# EAGLE design M602A (EAGLE 6.6.0)
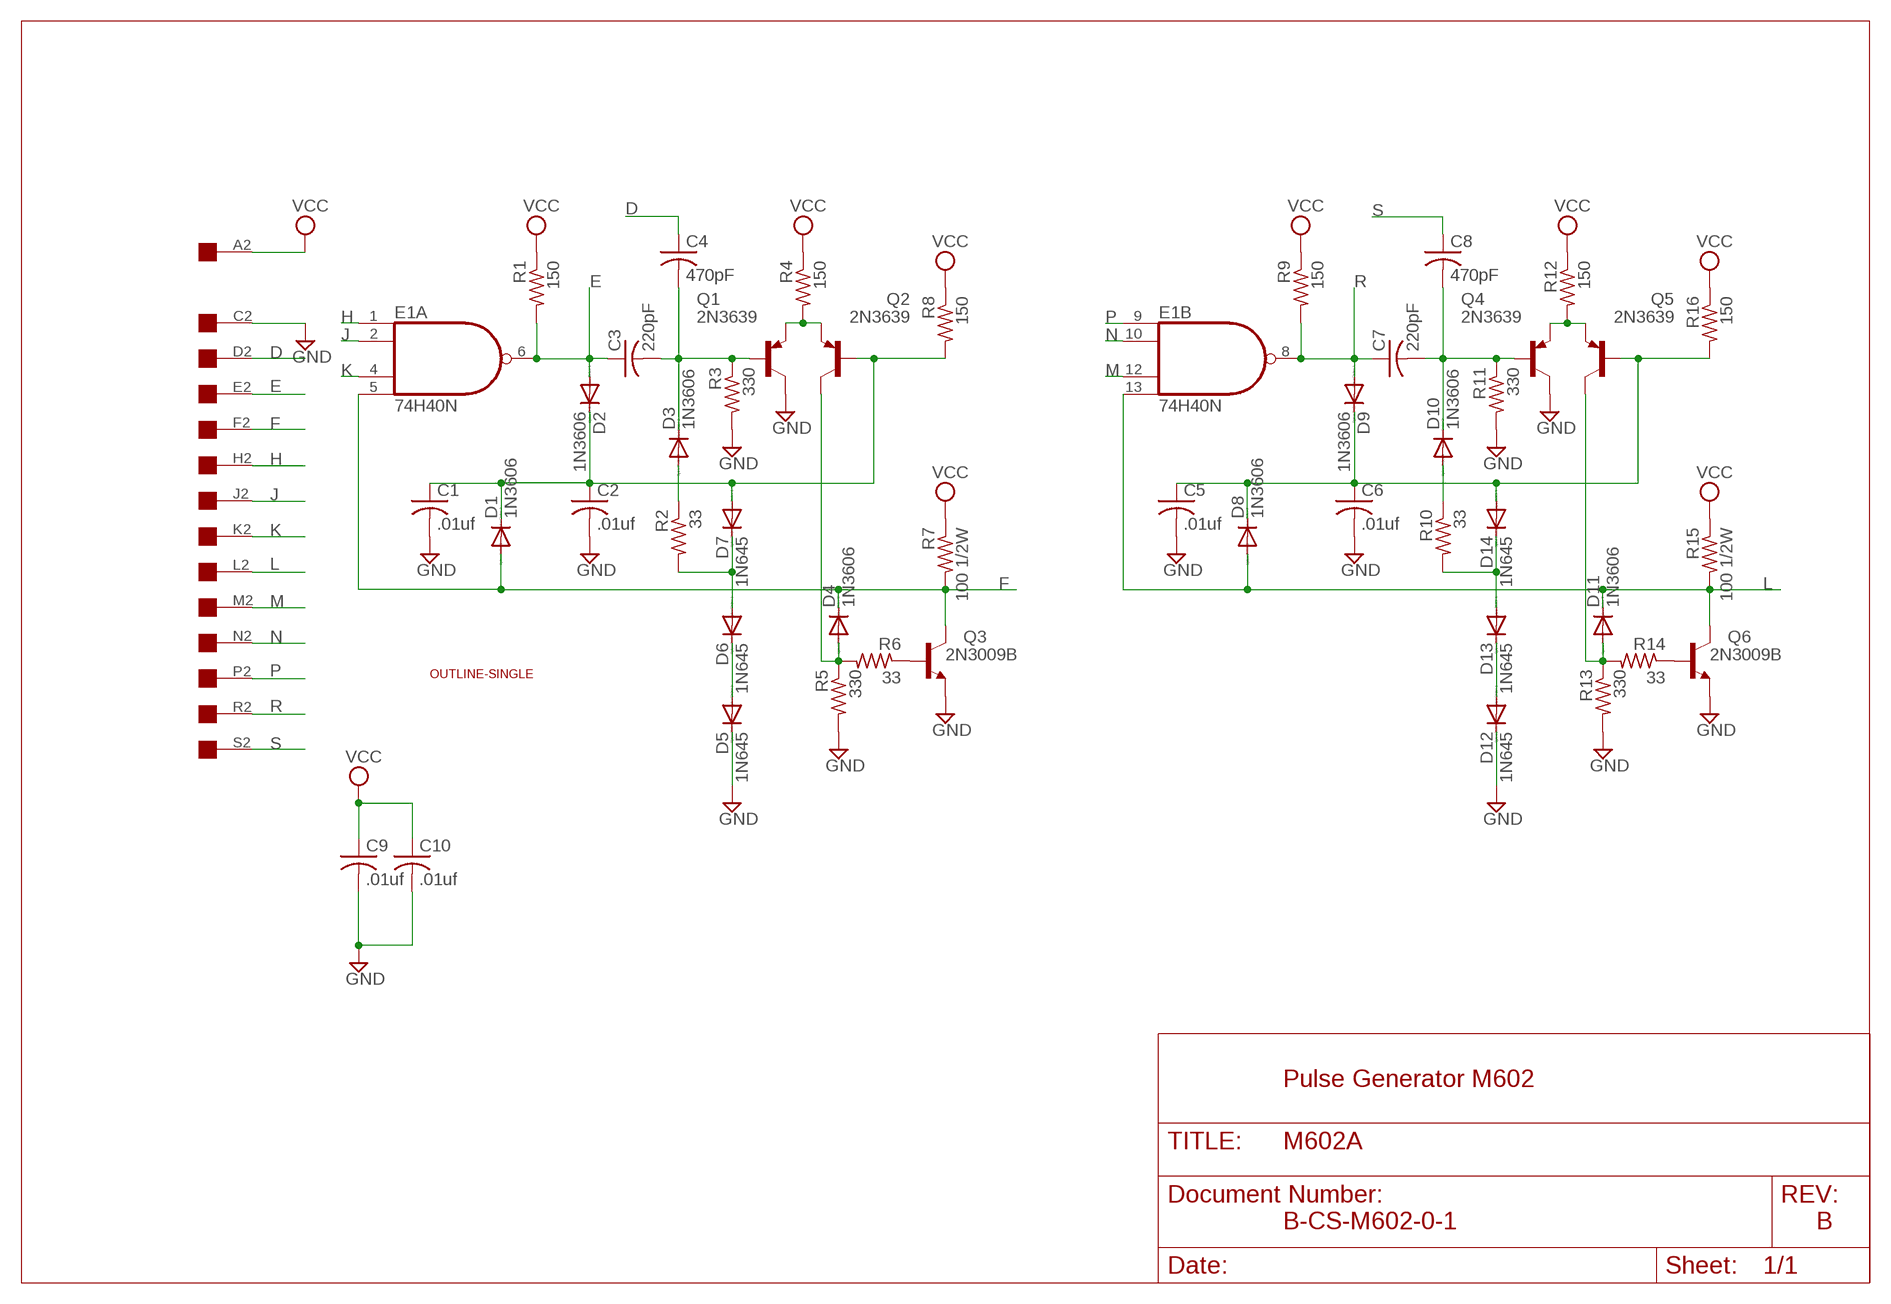
[diagram p0: schematic, sheet 1]

## Parts
C1  .01uf  C-US075-032X103  [C075-032X103]
C2  .01uf  C-US075-032X103  [C075-032X103]
C3  220pF  C-US150-054X183  [C150-054X183]
C4  470pF  C-US150-054X183  [C150-054X183]
C5  .01uf  C-US075-032X103  [C075-032X103]
C6  .01uf  C-US075-032X103  [C075-032X103]
C7  220pF  C-US150-054X183  [C150-054X183]
C8  470pF  C-US150-054X183  [C150-054X183]
C9  .01uf  C-US050-025X075  [C050-025X075]
C10  .01uf  C-US075-032X103  [C075-032X103]
D1  1N3606  1N4004  [DO41-10]
D2  1N3606  1N4004  [DO41-10]
D3  1N3606  1N4004  [DO41-10]
D4  1N3606  1N4004  [DO41-10]
D5  1N645  1N4004  [DO41-10]
D6  1N645  1N4004  [DO41-10]
D7  1N645  1N4004  [DO41-10]
D8  1N3606  1N4004  [DO41-10]
D9  1N3606  1N4004  [DO41-10]
D10  1N3606  1N4004  [DO41-10]
D11  1N3606  1N4004  [DO41-10]
D12  1N645  1N4004  [DO41-10]
D13  1N645  1N4004  [DO41-10]
D14  1N645  1N4004  [DO41-10]
E1  74H40N  74LS20N  [DIL14]
Q1  2N3639  2N5415  [TO39]
Q2  2N3639  2N5415  [TO39]
Q3  2N3009B  2N1711  [TO39]
Q4  2N3639  2N5415  [TO39]
Q5  2N3639  2N5415  [TO39]
Q6  2N3009B  2N1711  [TO39]
R1  150  R-US_0207/10  [0207/10]
R2  33  R-US_0207/10  [0207/10]
R3  330  R-US_0207/10  [0207/10]
R4  150  R-US_0207/10  [0207/10]
R5  330  R-US_0207/10  [0207/10]
R6  33  R-US_0207/10  [0207/10]
R7  100 1/2W  R-US_0309/12  [0309/12]
R8  150  R-US_0207/10  [0207/10]
R9  150  R-US_0207/10  [0207/10]
R10  33  R-US_0207/10  [0207/10]
R11  330  R-US_0207/10  [0207/10]
R12  150  R-US_0207/10  [0207/10]
R13  330  R-US_0207/10  [0207/10]
R14  33  R-US_0207/10  [0207/10]
R15  100 1/2W  R-US_0309/12  [0309/12]
R16  150  R-US_0207/10  [0207/10]
U$1  EDGE-1  [EDGE-CON1]
U$2  OUTLINE-SINGLE  [SINGLE]

## Nets
D: C4.1 U$1.D2
E: C3.1 D2.A E1.6(A:O) R1.2 U$1.E2
F: D1.A D4.C E1.5(A:I3) Q3.3(C) R7.2 U$1.F2
GND [Supply]: C1.2 C2.2 C5.2 C6.2 C9.2 C10.2 D5.C D12.C Q1.3(C) Q3.1(E) Q4.3(C) Q6.1(E) R3.2 R5.2 R11.2 R13.2 U$1.C2
H: E1.1(A:I0) U$1.H2
J: E1.2(A:I1) U$1.J2
K: E1.4(A:I2) U$1.K2
L: D8.A D11.C E1.13(B:I3) Q6.3(C) R15.2 U$1.L2
M: E1.12(B:I2) U$1.M2
N: E1.10(B:I1) U$1.N2
N$1: C1.1 C2.1 D1.C D2.C D7.A Q2.2(B) R8.2
N$2: D3.A R2.1
N$3: D10.A R10.1
N$4: C3.2 C4.2 D3.C Q1.2(B) R3.1
N$5: Q1.1(E) Q2.1(E) R4.2
N$6: D4.A Q2.3(C) R5.1 R6.2
N$7: Q3.2(B) R6.1
N$8: D6.A D7.C R2.2
N$9: D5.A D6.C
N$10: C7.2 C8.2 D10.C Q4.2(B) R11.1
N$11: C5.1 C6.1 D8.C D9.C D14.A Q5.2(B) R16.2
N$13: D13.A D14.C R10.2
N$14: D12.A D13.C
N$15: Q6.2(B) R14.1
N$16: Q4.1(E) Q5.1(E) R12.2
N$17: D11.A Q5.3(C) R13.1 R14.2
P: E1.9(B:I0) U$1.P2
R: C7.1 D9.A E1.8(B:O) R9.2 U$1.R2
S: C8.1 U$1.S2
VCC [Supply]: C9.1 C10.1 R1.1 R4.1 R7.1 R8.1 R9.1 R12.1 R15.1 R16.1 U$1.A2
Unconnected: U$1.B2 U$1.T2 U$1.U2 U$1.V2

## Notes on the sheet
- Pulse Generator M602
- B-CS-M602-0-1 | B

## Power pins joined to a net without a drawn wire
GND: E1.7(P:GND)
VCC: E1.14(P:VCC)

## Library data of the parts
C1-C10 = rcl:C-US: CAPACITOR, American symbol
D1-D14 = diode:1N4004: DIODE general purpose rectifier, 1 A
E1 = 74xx-us:74*20: Dual 4-input NAND gate
Q1 Q2 Q4 Q5 = transistor-pnp:2N5415*: PNP Transistror
Q3 Q6 = transistor-npn:2N1711: NPN Transistor
R1-R16 = rcl:R-US_: RESISTOR, American symbol
U$1 = dec-con:EDGE-1: Single-Sided DEC Edge Connector -- (side 2)
U$2 = dec-con:OUTLINE-*: Board outlines for DEC boards.

## Net classes
1 Supply: width 0.813 mm

## Board
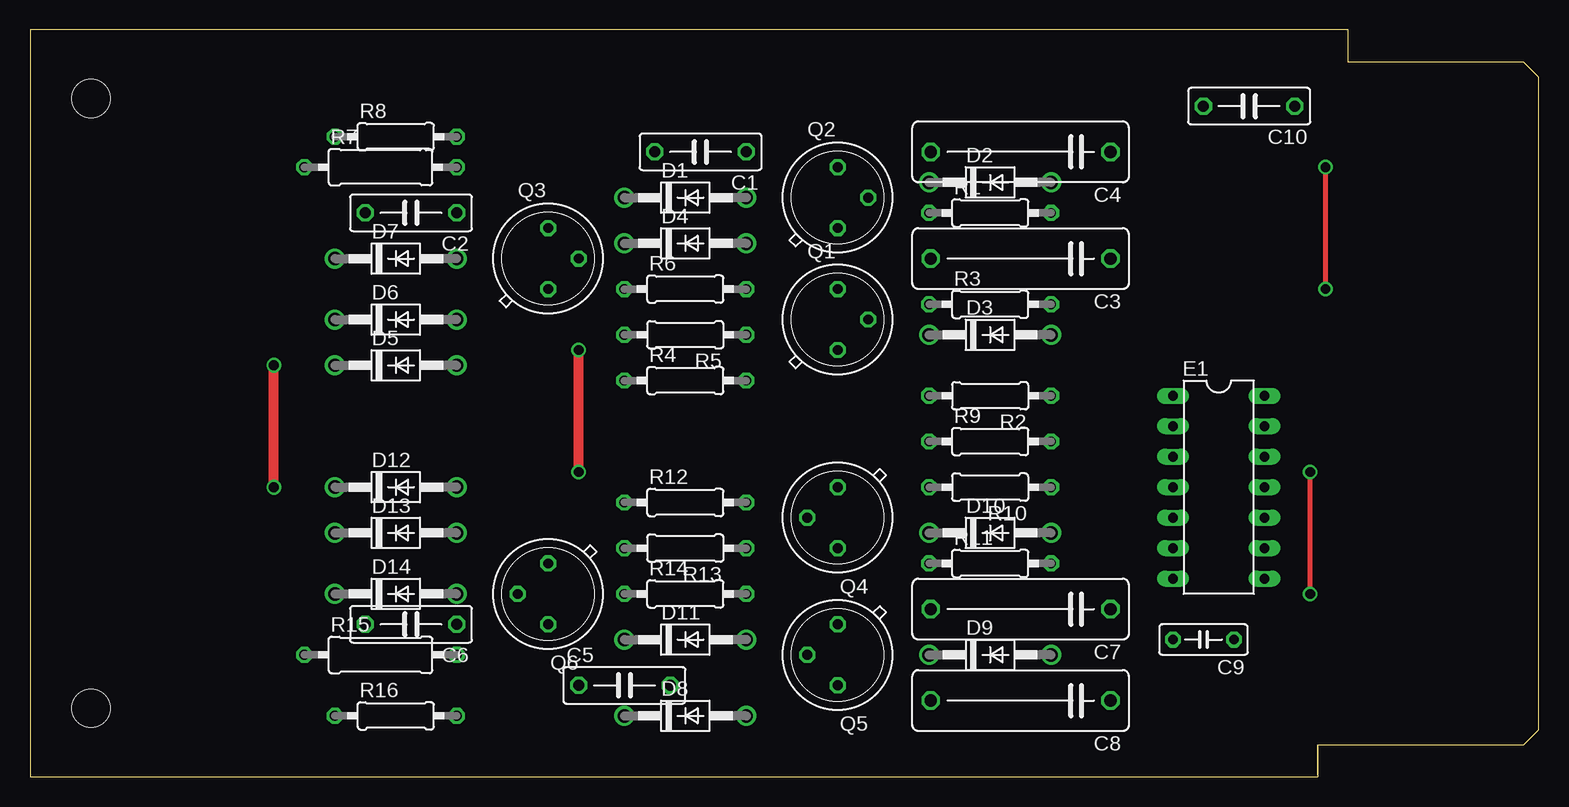
[diagram p1: board, top side]
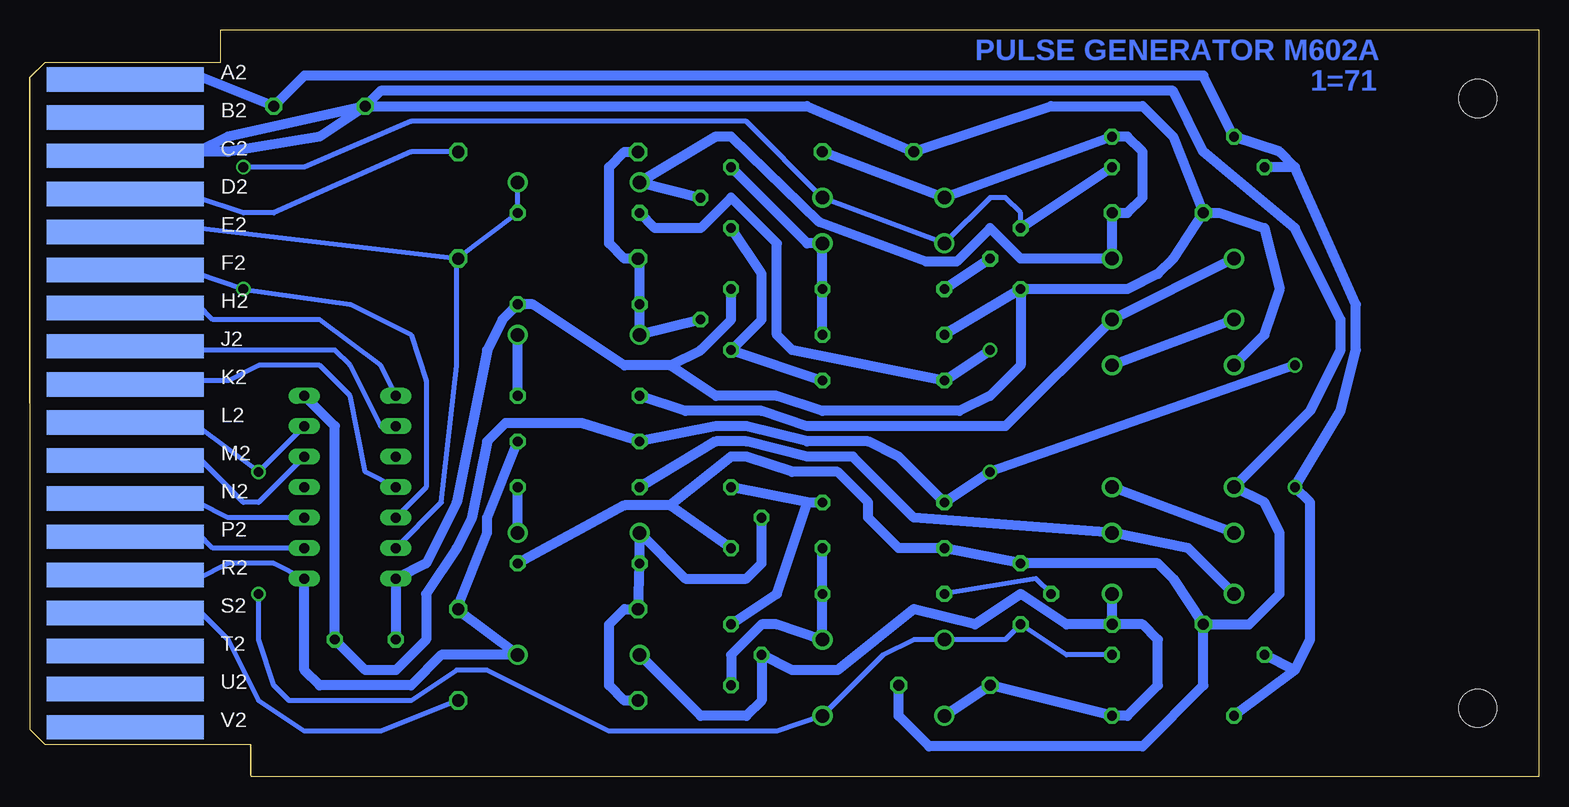
[diagram p2: board, bottom side, seen from below]

Size 125.73 x 62.23 mm. Coordinates in mm from the lower left corner, seen from the top.
Copper layers (1+16): Top 0.035mm / dielectric 1.5mm / Bottom 0.035mm
Design rules "16mils": minimum track width 16mil, minimum drill 32mil, track to track 15mil, track to pad 10mil, pad to pad 10mil, via to via 10mil, smd to smd 10mil, copper to edge 13mil, drill to drill 10mil, minimum pad ring 10mil, minimum via ring 8mil, stop-mask expansion 0mil, vias tented up to drill 0mil, thermal gap 10mil

### Footprints (pad centres in the part's own frame; a part is rotated, then mirrored left to right if it is on the bottom)
C075-032X103 = drill 0.914 octagon: 1 -3.81,0; 2 3.81,0
C150-054X183 = drill 1.016 octagon: 1 -7.493,0; 2 7.493,0
C050-025X075 = drill 0.813 octagon: 1 -2.54,0; 2 2.54,0
DO41-10 = drill 1.118: A 5.08,0; C -5.08,0
DIL14 = drill 0.813 long: 1 -7.62,-3.81; 2 -5.08,-3.81; 3 -2.54,-3.81; 4 0,-3.81; 5 2.54,-3.81; 6 5.08,-3.81; 7 7.62,-3.81; 8 7.62,3.81; 9 5.08,3.81; 10 2.54,3.81; 11 0,3.81; 12 -2.54,3.81; 13 -5.08,3.81; 14 -7.62,3.81
TO39 = drill 0.813 octagon: 1 0,-2.54; 2 2.54,0; 3 0,2.54
0207/10 = drill 0.813 octagon: 1 -5.08,0; 2 5.08,0
0309/12 = drill 0.813 octagon: 1 -6.35,0; 2 6.35,0
EDGE-CON1 = smd 13.106 x 2.032 bottom: A2 7.938,4.128; B2 7.938,7.303; C2 7.938,10.477; D2 7.938,13.652; E2 7.938,16.828; F2 7.938,20.003; H2 7.938,23.177; J2 7.938,26.352; K2 7.938,29.527; L2 7.938,32.703; M2 7.938,35.877; N2 7.938,39.053; P2 7.938,42.227; R2 7.938,45.403; S2 7.938,48.578; T2 7.938,51.752; U2 7.938,54.928; V2 7.938,58.102
SINGLE = hole 3.175: 120.65,56.515; 120.65,5.715

### Placement (x,y rotation side)
C1  55.88,52.07 180 top
C2  31.75,46.99 180 top
C3  82.55,43.18 180 top
C4  82.55,52.07 180 top
C5  49.53,7.62 0 top
C6  31.75,12.7 180 top
C7  82.55,13.97 180 top
C8  82.55,6.35 180 top
C9  97.79,11.43 180 top
C10  101.6,55.88 180 top
D1  54.61,48.26 0 top
D2  80.01,49.53 0 top
D3  80.01,36.83 0 top
D4  54.61,44.45 0 top
D5  30.48,34.29 0 top
D6  30.48,38.1 0 top
D7  30.48,43.18 0 top
D8  54.61,5.08 0 top
D9  80.01,10.16 0 top
D10  80.01,20.32 0 top
D11  54.61,11.43 0 top
D12  30.48,24.13 0 top
D13  30.48,20.32 0 top
D14  30.48,15.24 0 top
E1  99.06,24.13 270 top
Q1  67.31,38.1 0 top
Q2  67.31,48.26 0 top
Q3  43.18,43.18 0 top
Q4  67.31,21.59 180 top
Q5  67.31,10.16 180 top
Q6  43.18,15.24 180 top
R1  80.01,46.99 0 top
R2  80.01,31.75 180 top
R3  80.01,39.37 0 top
R4  54.61,33.02 0 top
R5  54.61,36.83 180 top
R6  54.61,40.64 0 top
R7  29.21,50.8 0 top
R8  30.48,53.34 0 top
R9  80.01,27.94 0 top
R10  80.01,24.13 180 top
R11  80.01,17.78 0 top
R12  54.61,22.86 0 top
R13  54.61,19.05 180 top
R14  54.61,15.24 0 top
R15  29.21,10.16 0 top
R16  30.48,5.08 0 top
U$1  125.73,62.23 180 top
U$2  125.73,62.23 180 top

### Tracks (layer width: path | path; a pad name or v marks a point on that pad's centre or on a via)
D
  Bottom 0.406: U$1.D2 116.84,48.26 111.76,48.26 107.95,46.99 105.41,46.99 93.98,52.07 C4.1
E
  Bottom 0.406: E1.6 91.44,22.86 90.17,34.29 90.17,43.18 | 90.17,43.18 111.76,45.72 116.84,45.72 U$1.E2 | 90.17,43.18 R1.2 D2.A
  Bottom 0.813: 90.17,43.18 C3.1
F  (via drill 0.81)
  Top 0.406: v107.95,50.8 v107.95,40.64
  Bottom 0.406: U$1.F2 116.84,41.91 111.76,41.91 v107.95,40.64 99.06,39.37 93.98,36.83 92.71,33.02 92.71,24.13 E1.5 | v107.95,50.8 102.87,50.8 93.98,54.61 66.04,54.61 D1.A D4.C 45.72,48.26 44.45,48.26 43.18,46.99 Q3.3
  Bottom 0.813: R7.2 Q3.3
GND
  Bottom 0.813: U$1.C2 116.84,52.07 111.76,52.07 | 111.76,52.07 109.22,53.34 C10.2 | 111.76,52.07 109.22,52.07 101.6,53.34 C10.2 | C10.2 60.96,55.88 C1.2 40.64,55.88 33.02,55.88 30.48,53.34 C2.2 | C2.2 30.48,43.18 31.75,41.91 34.29,40.64 Q3.1 | C10.2 96.52,57.15 30.48,57.15 27.94,52.07 20.32,45.72 16.51,38.1 16.51,35.56 19.05,30.48 D12.C 22.86,22.86 21.59,20.32 21.59,15.24 24.13,12.7 C6.2 | C6.2 30.48,16.51 31.75,17.78 Q6.1 R13.2 53.34,19.05 55.88,21.59 55.88,22.86 58.42,25.4 62.23,25.4 66.04,26.67 67.31,26.67 72.39,22.61 | C9.2 E1.7 92.71,17.78 90.17,22.86 87.63,35.56 86.36,38.1 R3.2 83.82,39.37 76.2,34.29 72.39,34.29 | 72.39,34.29 69.85,35.56 67.31,38.1 Q1.3 | Q3.1 43.18,34.29 45.72,31.75 48.26,30.48 59.69,30.48 63.5,31.75 68.58,31.75 72.39,34.29 | D5.C 22.86,36.83 21.59,40.64 22.86,45.72 26.67,46.99 C2.2 | C5.2 53.34,5.08 50.8,2.54 33.02,2.54 27.94,7.62 C6.2 | 72.39,22.61 Q4.3 | 72.39,22.61 76.2,22.61 R11.2 | Q3.1 R5.2
H
  Bottom 0.406: U$1.H2 116.84,39.37 111.76,39.37 110.49,38.1 101.6,38.1 96.52,34.29 E1.1
J
  Bottom 0.406: U$1.J2 116.84,35.56 100.33,35.56 99.06,34.29 96.52,29.21 E1.2
K
  Bottom 0.406: U$1.K2 116.84,33.02 109.22,33.02 106.68,34.29 101.6,34.29 99.06,31.75 97.79,25.4 E1.4
L  (via drill 0.81)
  Top 0.406: v106.68,15.24 v106.68,25.4
  Bottom 0.406: U$1.L2 116.84,29.21 111.76,29.21 v106.68,25.4 E1.13 | v106.68,15.24 106.68,11.43 105.41,7.62 104.14,6.35 93.98,6.35 90.17,8.89 87.63,8.89 77.47,3.81 63.5,3.81 D8.A 54.61,10.16 52.07,11.43 D11.C 44.45,11.43 Q6.3 39.37,10.16 R15.2
M
  Bottom 0.406: U$1.M2 116.84,26.67 111.76,26.67 107.95,22.86 106.68,22.86 E1.12
N
  Bottom 0.406: U$1.N2 116.84,22.86 111.76,22.86 109.22,21.59 E1.10
N$1
  Bottom 0.813: C1.1 D1.C R8.2 34.29,53.34 33.02,52.07 33.02,48.26 34.29,46.99 C2.1 D7.A 43.18,43.18 45.72,45.72 48.51,42.93 51.05,42.93 59.94,46.23 67.31,53.34 68.58,53.34 D2.C Q2.2
N$2
  Bottom 0.813: R2.1 D3.A
N$3
  Bottom 0.813: D10.A R10.1
N$4
  Bottom 0.813: C4.2 76.2,52.07 77.47,50.8 77.47,44.45 76.2,43.18 C3.2 74.93,43.18 R3.1 D3.C Q1.2
N$5
  Bottom 0.813: R4.2 Q1.1 64.77,38.1 64.77,41.91 Q2.1
N$6
  Bottom 0.813: R5.1 R6.2 D4.A 60.96,44.45 Q2.3
N$7
  Bottom 0.813: R6.1 Q3.2
N$8
  Bottom 0.813: D7.C D6.A 44.45,29.21 60.96,29.21 64.77,30.48 71.12,30.48 R2.2
N$9
  Bottom 0.813: D6.C D5.A
N$10
  Bottom 0.813: C8.2 76.2,6.35 77.47,7.62 77.47,12.7 76.2,13.97 C7.2 | C7.2 74.93,13.97 | C7.2 R11.1 D10.C 71.12,16.51 66.04,16.51 64.77,17.78 Q4.2
N$11
  Bottom 0.813: C6.1 33.02,12.7 31.75,11.43 31.75,7.62 34.29,5.08 R16.2 C5.1 D8.C | C6.1 D14.A | C6.1 39.37,12.7 43.18,15.24 46.99,12.7 52.07,13.97 58.42,8.89 62.23,8.89 Q5.2 64.77,6.35 66.04,5.08 69.85,5.08 D9.C
N$13
  Bottom 0.813: D14.C 29.21,19.05 D13.A 52.07,21.59 57.15,26.67 60.96,26.67 66.04,27.94 68.58,27.94 R10.2
N$14
  Bottom 0.813: D13.C D12.A
N$15
  Bottom 0.406: Q6.2 41.91,16.51 R14.1
N$16
  Bottom 0.813: 60.96,22.86 Q4.1 | Q5.1 63.5,15.24 60.96,22.86 | 60.96,22.86 R12.2
N$17
  Bottom 0.813: Q5.3 67.31,10.16 64.77,12.7 63.5,12.7 D11.A R14.2 R13.1
P
  Bottom 0.406: U$1.P2 116.84,20.32 111.76,20.32 110.49,19.05 E1.9
R
  Bottom 0.406: U$1.R2 116.84,16.51 111.76,16.51 109.22,17.78 105.41,17.78 E1.8
  Bottom 0.813: 90.17,13.97 C7.1 | 90.17,13.97 D9.A 91.44,10.16 93.98,7.62 101.6,7.62 102.87,8.89 E1.8 | R9.2 87.63,21.59 87.63,20.32 90.17,13.97
S
  Bottom 0.406: U$1.S2 117.14,13.66 116.84,13.97 111.76,13.97 109.22,11.43 106.68,6.35 102.87,3.81 96.52,3.81 90.17,6.35 C8.1
VCC  (via drill 0.81)
  Top 0.813: v20.32,24.13 v20.32,34.29 | v45.72,25.4 v45.72,35.56
  Bottom 0.813: U$1.A2 116.84,58.42 111.76,58.42 C10.1 102.87,58.42 27.94,58.42 R8.1 21.59,52.07 20.32,50.8 | 20.32,50.8 15.24,39.37 15.24,35.56 16.51,30.48 v20.32,24.13 19.05,22.86 19.05,11.43 20.32,8.89 | 20.32,8.89 R16.1 | 20.32,8.89 R15.1 | 20.32,50.8 R7.1 | v20.32,34.29 v45.72,25.4 R12.1 53.34,26.67 55.88,27.94 60.96,27.94 66.04,29.21 68.58,29.21 R9.1 79.76,29.46 86.11,29.46 87.63,27.94 88.9,21.59 90.17,19.05 92.71,15.24 92.71,11.43 95.25,8.89 97.79,8.89 C9.1 100.33,29.21 E1.14 | v45.72,35.56 R4.1 62.23,35.56 63.5,36.83 63.5,44.45 67.31,48.26 69.85,45.72 73.66,45.72 R1.1

### Text on the board
Bottom: PULSE GENERATOR M602A | 1=71